# EasyEDA Pro project ProProject_ESP32-CAN (1)_2024-07-23.epro, schematic kd8116 v1
Create Date: 2024-02-29; Page Name: P1; Project Name: P1; Schematic Name: Schematic1; Update Date: 2024-02-29; Company: EasyEDA.com; Drawn: EasyEDA; Page Size: A4; Part Number: JLCPCB-002; Reviewed: EasyEDA; Version: V0.1
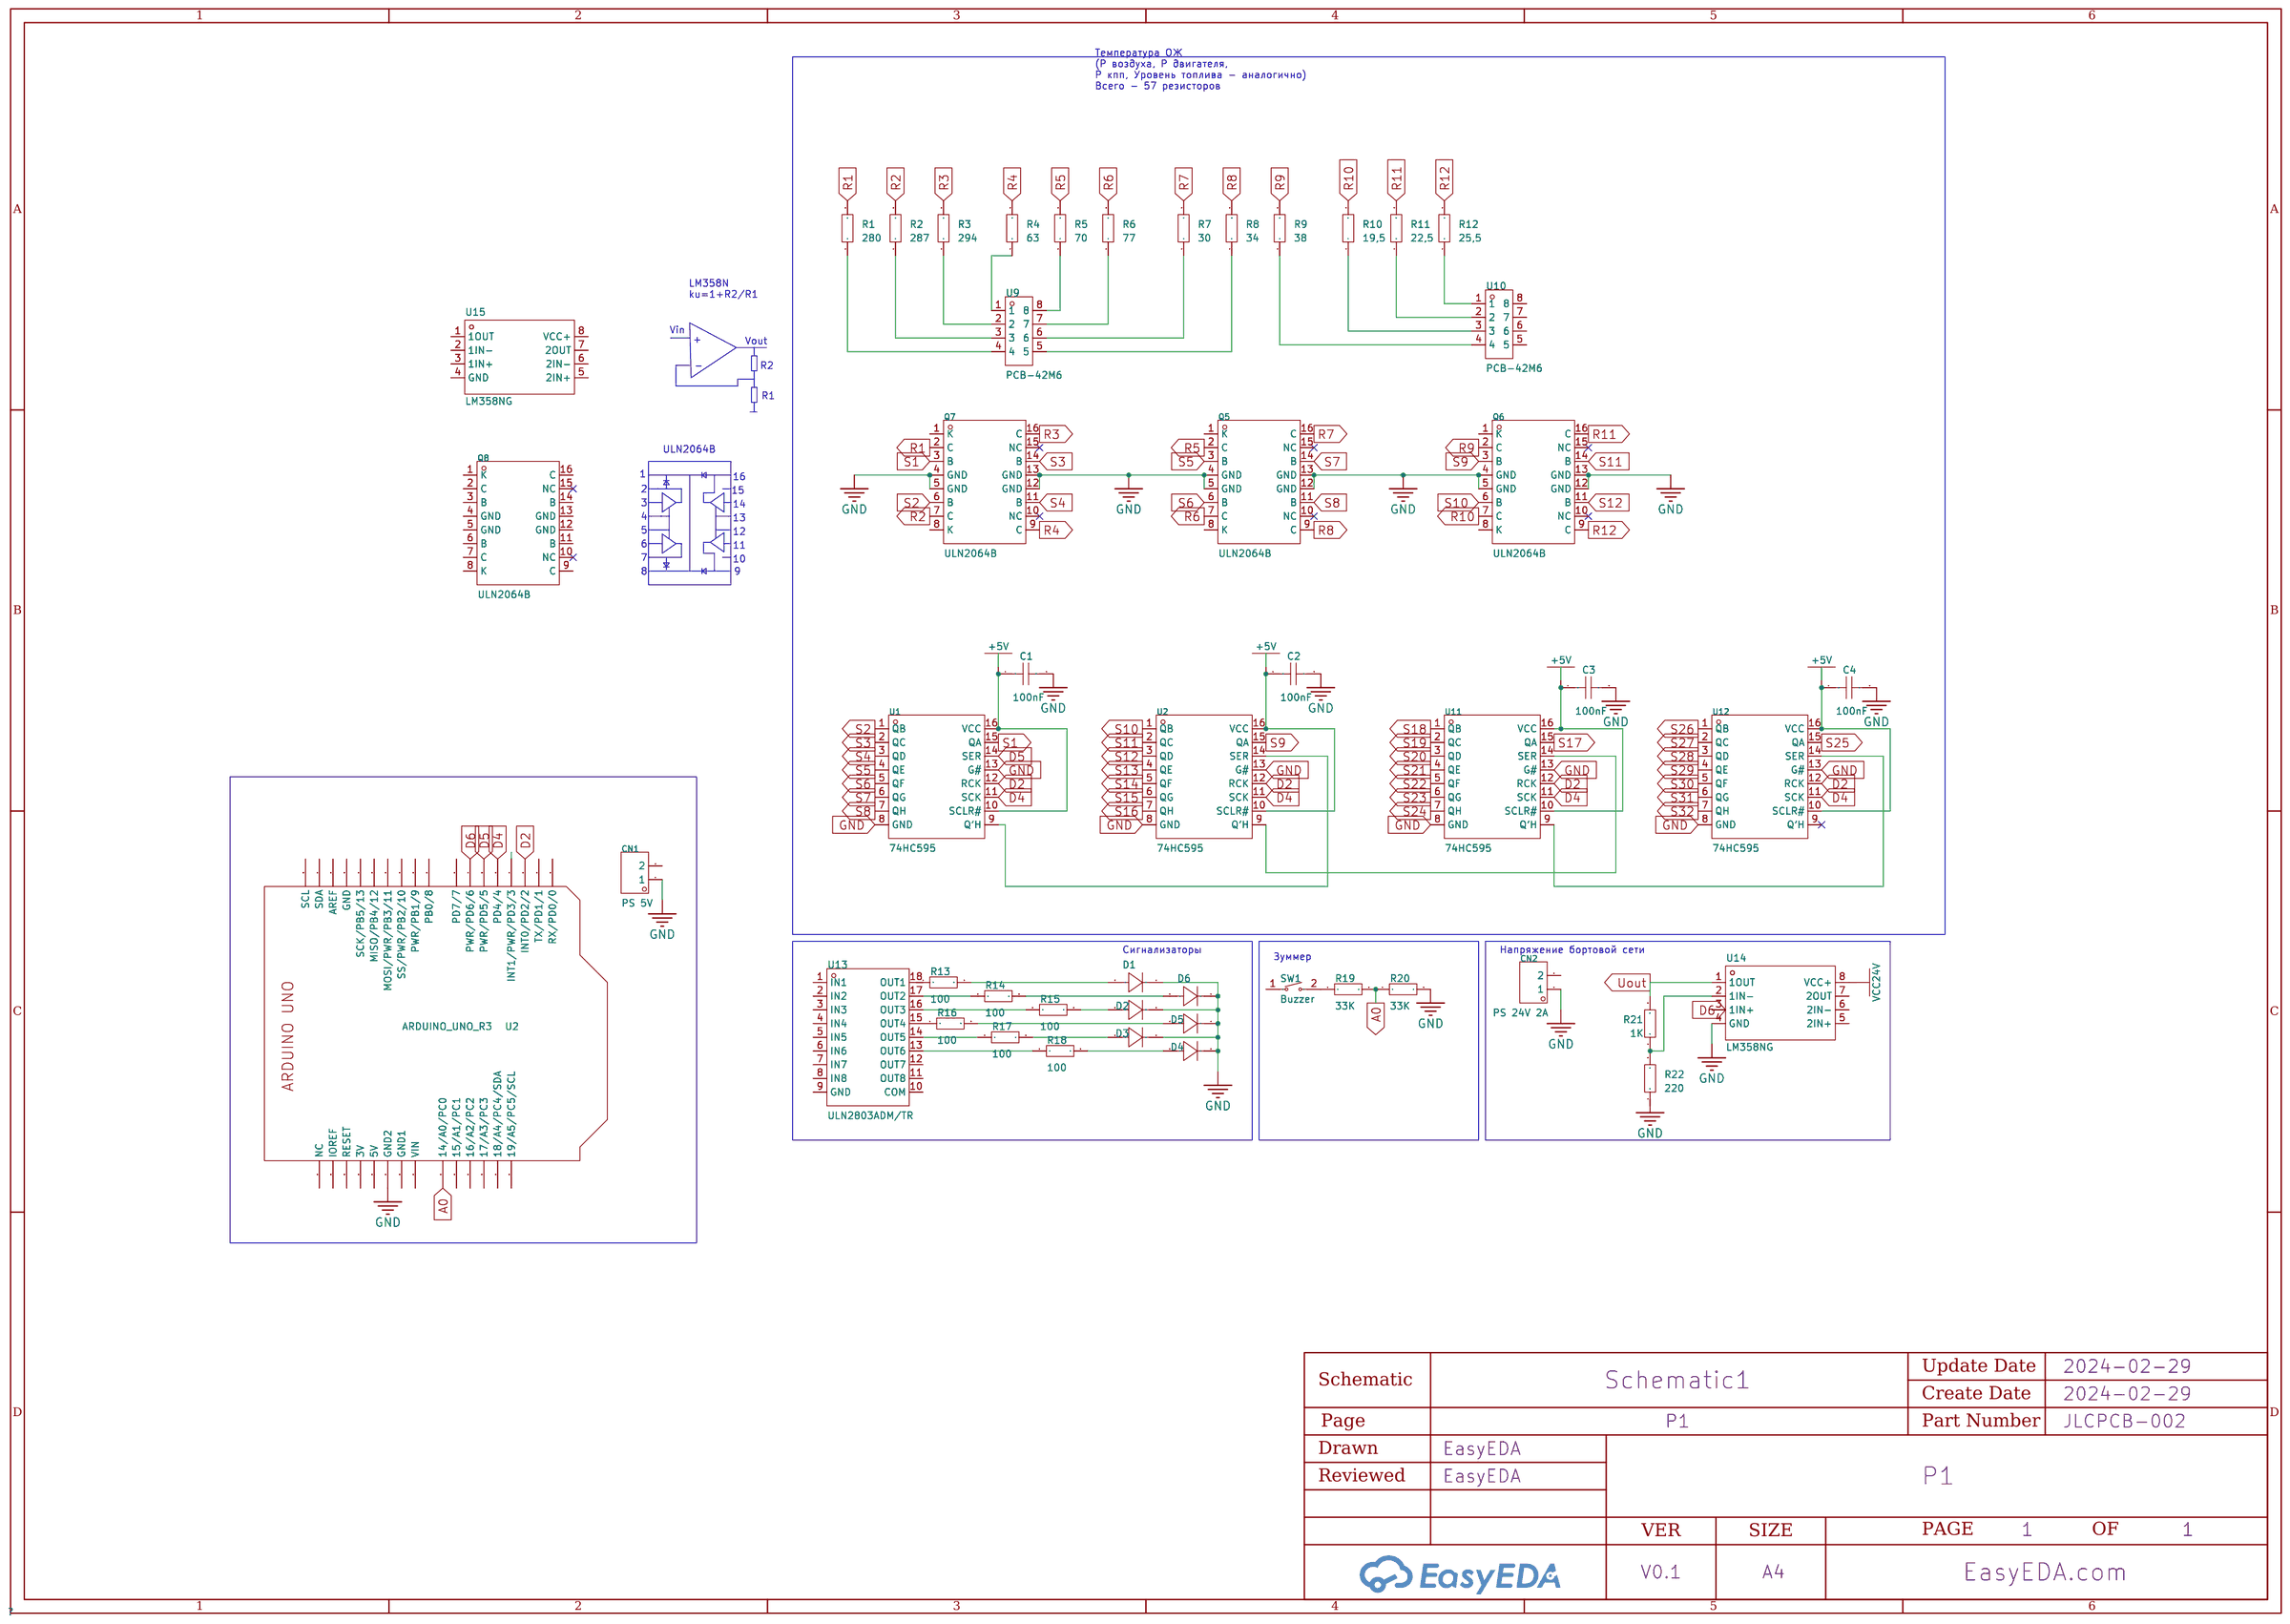
[diagram p2: schematic sheet]

## Parts
C1  100nF  [C0603]
C2  100nF  [C0603]
C3  100nF  [C0603]
C4  100nF  [C0603]
CN1  PS 5V  [CONN-TH_WJ2EDGVC-5.08-2P]
CN2  PS 24V 2A  [CONN-TH_WJ2EDGVC-5.08-2P]
D1  -  [DO-41_BD2.4-L4.7-P8.70-D0.9-RD]
D2  -  [DO-41_BD2.4-L4.7-P8.70-D0.9-RD]
D3  -  [DO-41_BD2.4-L4.7-P8.70-D0.9-RD]
D4  -  [DO-41_BD2.4-L4.7-P8.70-D0.9-RD]
D5  -  [DO-41_BD2.4-L4.7-P8.70-D0.9-RD]
D6  -  [DO-41_BD2.4-L4.7-P8.70-D0.9-RD]
Q5  ULN2064B  [PDIP-16_L22.1-W6.3-P2.54-LS7.6-BL]
Q6  ULN2064B  [PDIP-16_L22.1-W6.3-P2.54-LS7.6-BL]
Q7  ULN2064B  [PDIP-16_L22.1-W6.3-P2.54-LS7.6-BL]
Q8  ULN2064B  [PDIP-16_L22.1-W6.3-P2.54-LS7.6-BL]
R1  280  [R0603]
R2  287  [R0603]
R3  294  [R0603]
R4  63  [R0603]
R5  70  [R0603]
R6  77  [R0603]
R7  30  [R0603]
R8  34  [R0603]
R9  38  [R0603]
R10  19,5  [R0603]
R11  22,5  [R0603]
R12  25,5  [R0603]
R13  100  [R0603]
R14  100  [R0603]
R15  100  [R0603]
R16  100  [R0603]
R17  100  [R0603]
R18  100  [R0603]
R19  33K  [R0603]
R20  33K  [R0603]
R21  1K  [R0603]
R22  220  [R0603]
SW1  Buzzer  [KEY-SMD_L6.0-W3.5-LS8.0]
U1  74HC595  [SOP-16_L9.9-W3.9-P1.27-LS6.0-BL]
U2  ARDUINO_UNO_R3
U2#2  74HC595  [SOP-16_L9.9-W3.9-P1.27-LS6.0-BL]
U9  PCB-42M6  [TH_PCB-42M6]
U10  PCB-42M6  [TH_PCB-42M6]
U11  74HC595  [SOP-16_L9.9-W3.9-P1.27-LS6.0-BL]
U12  74HC595  [SOP-16_L9.9-W3.9-P1.27-LS6.0-BL]
U13  ULN2803ADM/TR  [SOP-18_L11.4-W7.6-P1.27-LS10.6-BL]
U14  LM358NG  [DIP-8_L10.1-W6.3-P2.54-LS7.6-BL]
U15  LM358NG  [DIP-8_L10.1-W6.3-P2.54-LS7.6-BL]

## Library data of the parts
C1-C4 = CAP_0603: Supplier Footprint: 0603
CN1 CN2 = WJ2EDGVC-5.08-2P: Connector Type:板端/Receptacle-Close Structure:1x2P Pitch:5.08mm Color:Green Mounting Style:直针 Number of Pins:2P Number of Rows:1 Number of PINs Per Row:2; LCSC Part Name: 5.08mm 1x2P 排数:1 每排P数:2; Supplier Part: C8445; Manufacturer: KANGNEX(康奈克斯电气); Supplier Footprint: 插件,P=5.08mm; JLCPCB Part Class: Extended Part; Datasheet: https://atta.szlcsc.com/upload/public/pdf/source/20191225/C8445_EB1D2D396D429FBA4C627FE17CC77AF0.pdf; Supplier: LCSC; Connector Type: 板端/Receptacle-Close; Structure: 1x2P; Pitch: 5.08mm; Color: Green; Mounting Style: 直针; Number of Pins: 2P; Number of Rows: 1; Number of PINs Per Row: 2
D1-D6 = 1N4007: Supplier Footprint: DO-41
Q5-Q8 = ULN2064B: Maximum collector Emitter Voltage (Vceo):50V Collector Current(Ic):1.75A; Supplier Part: C222080; Manufacturer: ST(意法半导体); Supplier Footprint: PowerDIP-16; JLCPCB Part Class: Extended Part; Datasheet: https://atta.szlcsc.com/upload/public/pdf/source/20180516/C222080_7A3C26329C276FCE285A80DD187C4CED.pdf; Supplier: LCSC; Maximum collector Emitter Voltage (Vceo): 50V; Collector Current(Ic): 1.75A
R1-R22 = Res_0603: Supplier Footprint: 0603
SW1 = BUTTON2,KEY: Supplier Part: C9900020455; Supplier: LCSC
U1 U2#2 U11 U12 = 74HC595: Function:串行至串行或并行 Supply Voltage:2V~6V Supply Voltage:2V~6V Number of Elements:1 Number of Bits per Element:8 Output Type:Tri-State Series: Operating Temperature:-40℃~+85℃ Operating Temperature:-40℃~+85℃; Supplier Part: C18164493; Manufacturer: GR(国睿); Supplier Footprint: SOP-16; Datasheet: https://atta.szlcsc.com/upload/public/pdf/source/20230915/F264A7C02E418D1689E15579DAA93EB8.pdf; Supplier: LCSC; Function: 串行至串行或并行; Supply Voltage: 2V~6V; Number of Elements: 1; Number of Bits per Element: 8; Output Type: Tri-State; Operating Temperature: -40℃~+85℃
U2 = ARDUINO_UNO_R3
U9 U10 = PCB-42M6螺母端子: Supplier Part: C9900020219; Supplier Footprint: PCB42; Supplier: LCSC
U13 = ULN2803ADM/TR: number of channels:八路; Supplier Part: C2683131; Manufacturer: HGSEMI(华冠); Supplier Footprint: SOP-18-300mil; JLCPCB Part Class: Extended Part; Datasheet: https://atta.szlcsc.com/upload/public/pdf/source/20231009/94AF2541D05EF3AF782C5D5776E3D68F.pdf; Supplier: LCSC; number of channels: 八路
U14 U15 = LM358NG: Number of Circuits:; Supplier Part: C7552; Supplier Footprint: DIP-8-300mil; JLCPCB Part Class: Extended Part; Supplier: LCSC

## Nets
+5V: C1.1 C2.1 C3.1 C4.1 U1.10(SCLR#) U1.16(VCC) U2#2.10(SCLR#) U2#2.16(VCC) U11.10(SCLR#) U11.16(VCC) U12.10(SCLR#) U12.16(VCC)
GND: C1.2 C2.2 C3.2 C4.2 CN1.1 CN2.1 D1.1(K) D2.1(K) D3.1(K) D4.1(K) D5.1(K) D6.1(K) Q5.4(GND) Q5.5(GND) Q5.12(GND) Q5.13(GND) Q6.4(GND) Q6.5(GND) Q6.12(GND) Q6.13(GND) Q7.4(GND) Q7.5(GND) Q7.12(GND) Q7.13(GND) R20.2 R22.1 U1.8(GND) U1.13(G#) U2.27(GND2) U2#2.8(GND) U2#2.13(G#) U11.8(GND) U11.13(G#) U12.8(GND) U12.13(G#) U14.4(GND)
VCC24V: U14.8(VCC+)
A0: R19.2 R20.1 U2.24(14/A0/PC0)
D2: U1.12(RCK) U2.3(INT0/PD2/2) U2#2.12(RCK) U11.12(RCK) U12.12(RCK)
D4: U1.11(SCK) U2.5(PD4/4) U2#2.11(SCK) U11.11(SCK) U12.11(SCK)
D5: U1.14(SER) U2.6(PWR/PD5/5)
D6: U2.7(PWR/PD6/6) U14.3(1IN+)
R1: Q7.2(C) R1.2
R2: Q7.7(C) R2.2
R3: Q7.16(C) R3.2
R4: Q7.9(C) R4.2
R5: Q5.2(C) R5.2
R6: Q5.7(C) R6.2
R7: Q5.16(C) R7.2
R8: Q5.9(C) R8.2
R9: Q6.2(C) R9.2
R10: Q6.7(C) R10.2
R11: Q6.16(C) R11.2
R12: Q6.9(C) R12.2
S1: Q7.3(B) U1.15(QA)
S2: Q7.6(B) U1.1(QB)
S3: Q7.14(B) U1.2(QC)
S4: Q7.11(B) U1.3(QD)
S5: Q5.3(B) U1.4(QE)
S6: Q5.6(B) U1.5(QF)
S7: Q5.14(B) U1.6(QG)
S8: Q5.11(B) U1.7(QH)
S9: Q6.3(B) U2#2.15(QA)
S10: Q6.6(B) U2#2.1(QB)
S11: Q6.14(B) U2#2.2(QC)
S12: Q6.11(B) U2#2.3(QD)
S13: U2#2.4(QE)
S14: U2#2.5(QF)
S15: U2#2.6(QG)
S16: U2#2.7(QH)
S17: U11.15(QA)
S18: U11.1(QB)
S19: U11.2(QC)
S20: U11.3(QD)
S21: U11.4(QE)
S22: U11.5(QF)
S23: U11.6(QG)
S24: U11.7(QH)
S25: U12.15(QA)
S26: U12.1(QB)
S27: U12.2(QC)
S28: U12.3(QD)
S29: U12.4(QE)
S30: U12.5(QF)
S31: U12.6(QG)
S32: U12.7(QH)
Uout: R21.2 U14.1(1OUT)
Net-(D1-2): D1.2(A) R13.2
Net-(D2-2): D2.2(A) R15.2
Net-(D3-2): D3.2(A) R17.2
Net-(D4-2): D4.2(A) R18.2
Net-(D5-2): D5.2(A) R16.2
Net-(D6-2): D6.2(A) R14.2
Net-(R1-1): R1.1 U9.4
Net-(R2-1): R2.1 U9.3
Net-(R3-1): R3.1 U9.2
Net-(R4-1): R4.1 U9.1
Net-(R5-1): R5.1 U9.8
Net-(R6-1): R6.1 U9.7
Net-(R7-1): R7.1 U9.6
Net-(R8-1): R8.1 U9.5
Net-(R9-1): R9.1 U10.4
Net-(R10-1): R10.1 U10.3
Net-(R11-1): R11.1 U10.2
Net-(R12-1): R12.1 U10.1
Net-(R13-1): R13.1 U13.18(OUT1)
Net-(R14-1): R14.1 U13.17(OUT2)
Net-(R15-1): R15.1 U13.16(OUT3)
Net-(R16-1): R16.1 U13.15(OUT4)
Net-(R17-1): R17.1 U13.14(OUT5)
Net-(R18-1): R18.1 U13.13(OUT6)
Net-(R19-1): R19.1 SW1.2
Net-(R21-1): R21.1 R22.2 U14.2(1IN-)
Net-(U1-9): U1.9(Q′H) U2#2.14(SER)
Net-(U2#2-9): U2#2.9(Q′H) U11.14(SER)
Net-(U11-9): U11.9(Q′H) U12.14(SER)

Not connected (* = marked no-connect by the designer): CN1 2; CN2 2; Q5 1(K) 8(K) 10(NC)* 15(NC)*; Q6 1(K) 8(K) 10(NC)* 15(NC)*; Q7 1(K) 8(K) 10(NC)* 15(NC)*; Q8 1(K) 2(C) 3(B) 4(GND) 5(GND) 6(B) 7(C) 8(K) 9(C) 10(NC)* 11(B) 12(GND) 13(GND) 14(B) 15(NC)* 16(C); SW1 1; U2 1(RX/PD0/0) 2(TX/PD1/1) 4(INT1/PWR/PD3/3) 8(PD7/7) 9(PB0/8) 10(PWR/PB1/9) 11(SS/PWR/PB2/10) 12(MOSI/PWR/PB3/11) 13(MISO/PB4/12) 14(SCK/PB5/13) 15(GND) 16(AREF) 17(SDA) 18(SCL) 19(19/A5/PC5/SCL) 20(18/A4/PC4/SDA) 21(17/A3/PC3) 22(16/A2/PC2) 23(15/A1/PC1) 25(VIN) 26(GND1) 28(5V) 29(3V) 30(RESET) 31(IOREF) 32(NC); U10 5 6 7 8; U12 9(Q′H)*; U13 1(IN1) 2(IN2) 3(IN3) 4(IN4) 5(IN5) 6(IN6) 7(IN7) 8(IN8) 9(GND) 10(COM) 11(OUT8) 12(OUT7); U14 5(2IN+) 6(2IN-) 7(2OUT); U15 1(1OUT) 2(1IN-) 3(1IN+) 4(GND) 5(2IN+) 6(2IN-) 7(2OUT) 8(VCC+)

## Notes on the sheet
- Температура ОЖ
  (P воздуха, P двигателя,
  P кпп, Уровень топлива - аналогично)
  Всего - 57 резисторов
- LM358N
  ku=1+R2/R1
- Vin
- +
- Vout
- -
- R2
- R1
- ULN2064B
- 1
- 16
- 2
- 15
- 3
- 14
- 4
- 13
- 5
- 12
- 6
- 7
- 10
- 11
- 8
- 9
- Сигнализаторы
- Зуммер
- Напряжение бортовой сети
